# Altium project 高低压调节.PrjPCB
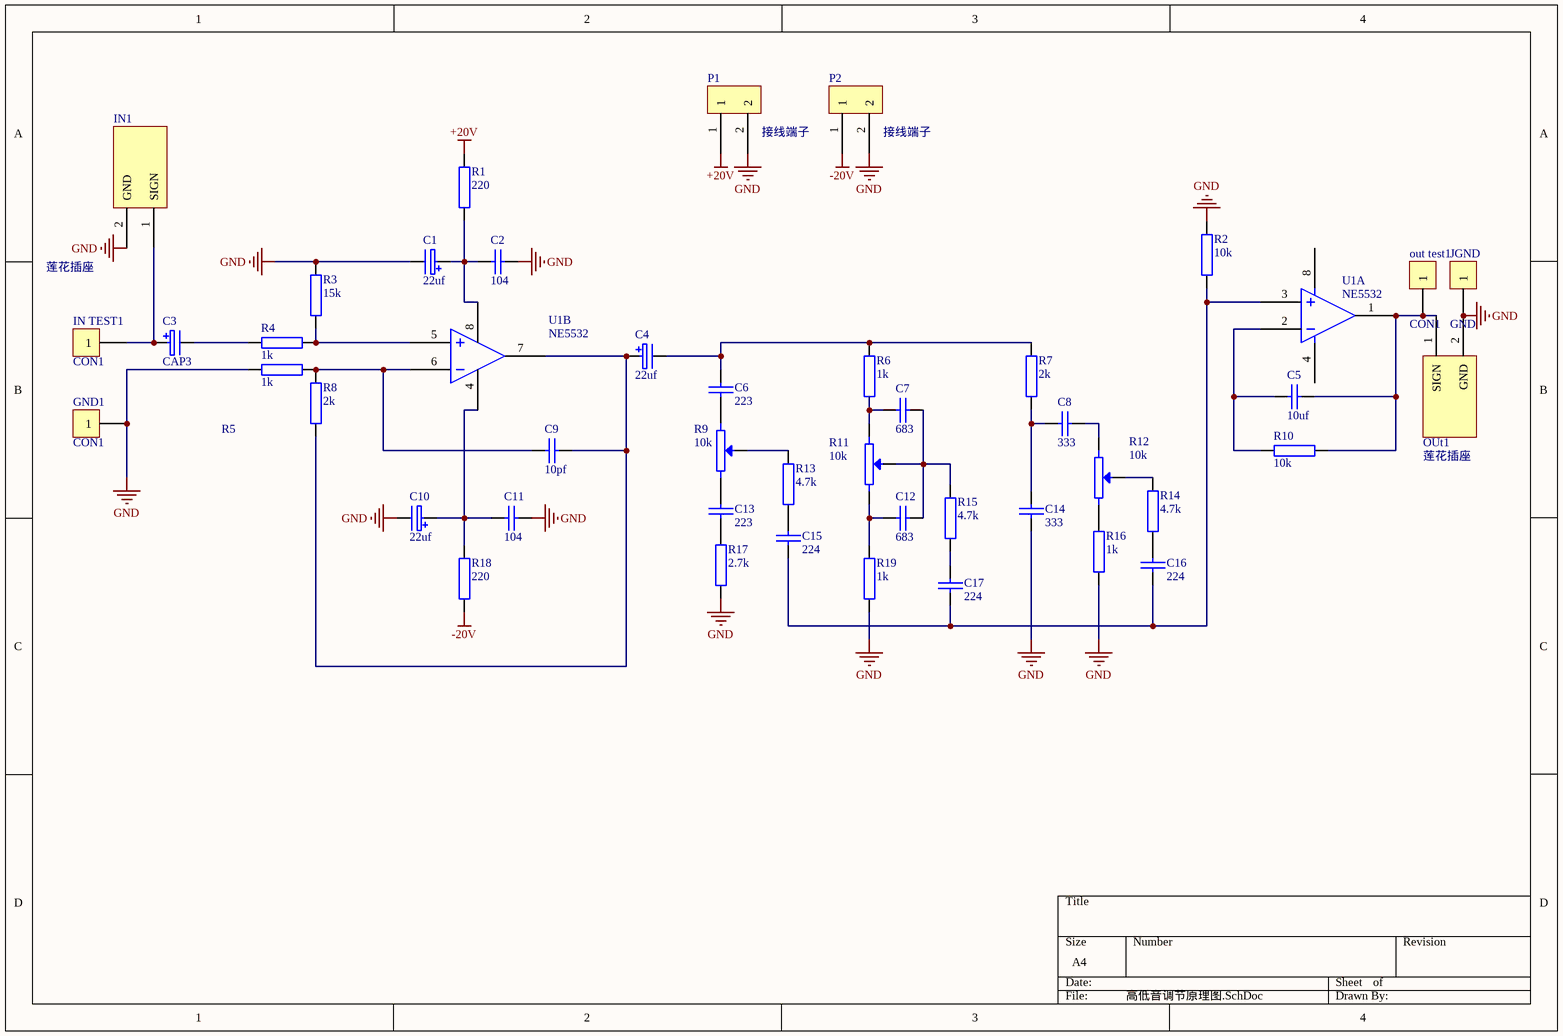
[diagram p0: 高低音调节原理图.SchDoc]
1 sheet, 45 parts. Net scope: global (net labels, ports and power ports of the same name join across sheets).
Board file: PCB1.PcbDoc

## Sheet 高低音调节原理图.SchDoc
size A4

### Parts
C1  22uf  [CAO2]
C2  104  [CAP2]
C3  CAP3  [CAO2]
C4  22uf  [CAO2]
C5  10uf  [CAP2]
C6  223  [CAP2]
C7  683  [CAP2]
C8  333  [CAP2]
C9  10pf  [CAP2]
C10  22uf  [CAO2]
C11  104  [CAP2]
C12  683  [CAP2]
C13  223  [CAP2]
C14  333  [CAP2]
C15  224  [CAP2]
C16  224  [CAP2]
C17  224  [CAP2]
GND1  CON1  [SIP-1]
IN1  莲花插座  [莲花母座]
IN_TEST1  CON1  [SIP-1]
JGND  GND  [SIP-1]
OUt1  莲花插座  [莲花母座]
out_test1  CON1  [SIP-1]
P1  接线端子  [接线端子]
P2  接线端子  [接线端子]
R1  220  [AXIAL0.4]
R2  10k  [AXIAL0.4]
R3  15k  [AXIAL0.4]
R4  1k  [AXIAL0.4]
R5  1k  [AXIAL0.4]
R6  1k  [AXIAL0.4]
R7  2k  [AXIAL0.4]
R8  2k  [AXIAL0.4]
R9  10k  [RVR-A]
R10  10k  [AXIAL0.4]
R11  10k  [RVR-A]
R12  10k  [RVR-A]
R13  4.7k  [AXIAL0.4]
R14  4.7k  [AXIAL0.4]
R15  4.7k  [AXIAL0.4]
R16  1k  [AXIAL0.4]
R17  2.7k  [AXIAL0.4]
R18  220  [AXIAL0.4]
R19  1k  [AXIAL0.4]
U1  NE5532  [DIP-8]  (parts A,B of 2)

### Nets
+20V: P1.1 R1.2
-20V: P2.1 R18.1
GND: C1.2 C2.1 C10.2 C11.1 C14.2 GND1.1 IN1.2(GND) JGND.1 OUt1.2(GND) P1.2 P2.2 R2.2 R3.2 R5.1 R16.1 R17.1 R19.1
NetC1_1: C1.1 C2.2 R1.1 U1.8
NetC3_1: C3.1 IN1.1(SIGN) IN_TEST1.1
NetC3_2: C3.2 R4.1
NetC4_1: C4.1 C9.1 R8.1 U1.7
NetC4_2: C4.2 C6.1 R6.2 R7.2
NetC5_1: C5.1 OUt1.1(SIGN) out_test1.1 R10.2 U1.1
NetC5_2: C5.2 R10.1 U1.2
NetC6_2: C6.2 R9.1
NetC7_1: C7.1 C12.1 R11.2(W) R15.2
NetC7_2: C7.2 R6.1 R11.1
NetC8_1: C8.1 R12.1
NetC8_2: C8.2 C14.1 R7.1
NetC9_2: C9.2 R5.2 R8.2 U1.6
NetC10_1: C10.1 C11.2 R18.2 U1.4
NetC12_2: C12.2 R11.3 R19.2
NetC13_1: C13.1 R9.3
NetC13_2: C13.2 R17.2
NetC15_1: C15.1 R13.1
NetC15_2: C15.2 C16.2 C17.2 R2.1 U1.3
NetC16_1: C16.1 R14.1
NetC17_1: C17.1 R15.1
NetR3_1: R3.1 R4.2 U1.5
NetR9_2: R9.2(W) R13.2
NetR12_2: R12.2(W) R14.2
NetR12_3: R12.3 R16.2

### Library data of the parts
C1 C4 C10 = CAP3
C2 C5-C9 C11-C17 = CAP1
GND1 IN_TEST1 JGND out_test1 = CON1: Connector
IN1 OUt1 = PCA
R1 R3-R5 R8 R13 R17-R19 = RES: 电阻
R2 R6 R7 R10 R14-R16 = RES
R9 R11 R12 = RPOT-1: Potentiometer
U1 = 1458: OPA2134: The OPA134 series are ultra-low distortion, low noise  operational amplifiers fully specified for audio appli-  cations. A true FET input stage was incorporated to  provide superior sound quality and speed for excep-  tional audio performance.